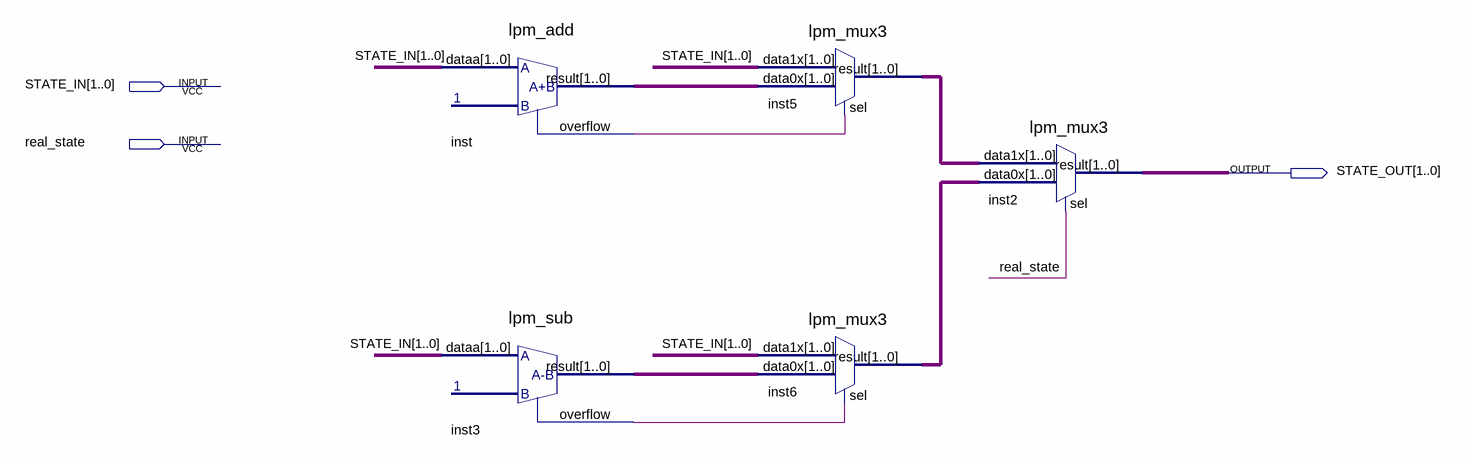
[diagram p0: schematic sheet]
// Quartus schematic A3.bdf as structural Verilog: 5 symbols, 3 pins
module A3 (
  input  [1:0] STATE_IN,
  input  real_state,
  output [1:0] STATE_OUT
);

  wire inst3_overflow, inst_overflow;
  wire [1:0] inst3_result, inst5_result, inst6_result, inst_result;

  lpm_add inst (.dataa(STATE_IN), .result(inst_result), .overflow(inst_overflow));
  lpm_sub inst3 (.dataa(STATE_IN), .result(inst3_result), .overflow(inst3_overflow));
  lpm_mux3 inst5 (.data1x(STATE_IN), .data0x(inst_result), .sel(inst_overflow), .result(inst5_result));
  lpm_mux3 inst6 (.data1x(STATE_IN), .data0x(inst3_result), .sel(inst3_overflow), .result(inst6_result));
  lpm_mux3 inst2 (.data1x(inst5_result), .data0x(inst6_result), .sel(real_state), .result(STATE_OUT));
endmodule
